# EAGLE design BQ25616_EvalBoard (EAGLE 9.6.2)
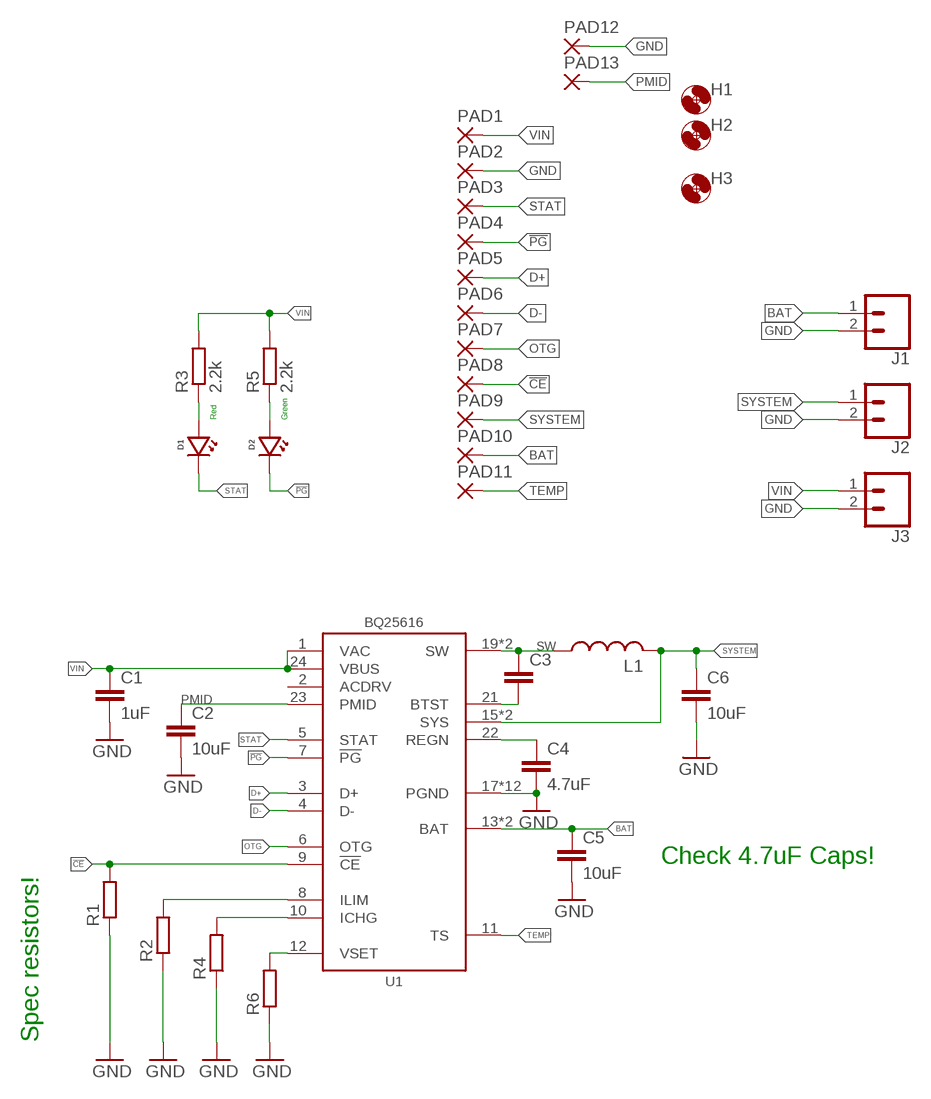
[diagram p0: schematic, sheet 1]

## Parts
C1  1uF  C-EU1UFC0603  [C0603]
C2  10uF  C-EU10UFC0805  [C0805]
C3  C-EUC0603  [C0603]
C4  4.7uF  C-EU4.7UFC0805  [C0805]
C5  10uF  C-EU10UFC0805  [C0805]
C6  10uF  C-EU10UFC0805  [C0805]
D1  LEDGREEN0603  [LED_0603]
D2  LEDRED0603  [LED_0603]
H1  MOUNTING_HOLE2_NP  [2_56]
H2  MOUNTING_HOLE2_NP  [2_56]
H3  MOUNTING_HOLE2_NP  [2_56]
J1  CONN_023.5MM_ROUND_RESTRICT  [SCREWTERMINAL-3.5MM-2_ROUND_RESTRICT]
J2  CONN_023.5MM_ROUND_RESTRICT  [SCREWTERMINAL-3.5MM-2_ROUND_RESTRICT]
J3  CONN_023.5MM_ROUND_RESTRICT  [SCREWTERMINAL-3.5MM-2_ROUND_RESTRICT]
L1  INDUCTORMAIA_4.1X4.1  [WE-MAIA(4.1X4.1)]
PAD1  SMD1,27  [SMD1,27-2,54]
PAD2  SMD1,27  [SMD1,27-2,54]
PAD3  SMD1,27  [SMD1,27-2,54]
PAD4  SMD1,27  [SMD1,27-2,54]
PAD5  SMD1,27  [SMD1,27-2,54]
PAD6  SMD1,27  [SMD1,27-2,54]
PAD7  SMD1,27  [SMD1,27-2,54]
PAD8  SMD1,27  [SMD1,27-2,54]
PAD9  SMD1,27  [SMD1,27-2,54]
PAD10  SMD1,27  [SMD1,27-2,54]
PAD11  SMD1,27  [SMD1,27-2,54]
PAD12  SMD1,27  [SMD1,27-2,54]
PAD13  SMD1,27  [SMD1,27-2,54]
R1  R-EU_R0603  [R0603]
R2  R-EU_R0603  [R0603]
R3  2.2k  R-EU_2.2KR0603  [R0603]
R4  R-EU_R0603  [R0603]
R5  2.2k  R-EU_2.2KR0603  [R0603]
R6  R-EU_R0603  [R0603]
U1  BQ25616  [QFN24_POWER]

## Nets
!CE: PAD8.1(P) R1.2 U1.9(!CE)
!PG: D2.CATHODE PAD4.1(P) U1.7(!PG)
BAT: C5.1 J1.1 PAD10.1(P) U1.13(BAT) U1.14(BAT)
D+: PAD5.1(P) U1.3(D+)
D-: PAD6.1(P) U1.4(D-)
GND: C1.2 C2.2 C4.2 C5.2 C6.2 J1.2 J2.2 J3.2 PAD2.1(P) PAD12.1(P) R1.1 R2.1 R4.1 R6.1 U1.17(PGND) U1.18(PGND) U1.EP(PGND) U1.EP@1(PGND) U1.EP@2(PGND) U1.EP@3(PGND) U1.EP@4(PGND) U1.EP@5(PGND) U1.EP@6(PGND) U1.EP@7(PGND) U1.EP@8(PGND) U1.EP@9(PGND)
N$2: C4.1 U1.22(REGN)
N$4: C3.2 U1.21(BTST)
N$5: D2.ANODE R5.1
N$6: D1.ANODE R3.1
N$8: R6.2 U1.12(VSET)
N$9: R4.2 U1.10(ICHG)
N$10: R2.2 U1.8(ILIM)
OTG: PAD7.1(P) U1.6(OTG)
PMID: C2.1 PAD13.1(P) U1.23(PMID)
STAT: D1.CATHODE PAD3.1(P) U1.5(STAT)
SW: C3.1 L1.P$1 U1.19(SW) U1.20(SW)
SYSTEM: C6.1 J2.1 L1.P$2 PAD9.1(P) U1.15(SYS) U1.16(SYS)
TEMP: PAD11.1(P) U1.11(TS)
VIN: C1.1 J3.1 PAD1.1(P) R3.2 R5.2 U1.1(VAC) U1.24(VBUS)
Unconnected: U1.2(ACDRV)

## Notes on the sheet
- Red | Green
- Check 4.7uF Caps!
- Spec resistors!

## Library data of the parts
C1 = bschulz_passives:C-EU: CAPACITOR, European symbol; DIGIKEY: 587-1251-1-ND; MF: Yaiyo Yuden; MPN: EMK107BJ105KA-T
C2 C5 C6 = bschulz_passives:C-EU: CAPACITOR, European symbol; DIGIKEY: 490-6473-6-ND; MF: Murata; MPN: GRM21BR61C106KE15K
C3 = bschulz_passives:C-EU: CAPACITOR, European symbol
C4 = bschulz_passives:C-EU: CAPACITOR, European symbol; DIGIKEY: 399-7415-1-ND; MF: Kemet; MPN: C0805C475K4RACTU
D1 = bschulz:LED: Genaric LED; DIGIKEY: 732-4971-1-ND; MF: Wurth; MPN: 150060GS75000
D2 = bschulz:LED: Genaric LED; DIGIKEY: 732-4978-1-ND; MF: Wurth; MPN: 150060RS75000
H1-H3 = bschulz:MOUNTING_HOLE: Genaric Mechanical Mounting Hole Hole diameter based on max body diameter + 15% Keepout ring is for diameter of socket cap screw (minimum required clearance) TPlace ring is for diameter of pan head screw (recomended clearance) Specifications: Socket Cap <http://fastener-express.com/fastener-technical/SocketscapSS-Alloy.pdf> Button Head Socket Cap <http://fastener-express.com/fastener-technical/Button-Socket-alloy.pdf> Pan Head <http://fastener-express.com/fastener-technical/pan-machine-Screws.pdf>; DIGIKEY: DNP; MF: N/A; MPN: DNP
J1-J3 = bschulz:CONN_02: Genaric 2 terminal header SCREW_2.54 <https://www.digikey.com/product-detail/en/on-shore-technology-inc/OSTVN02A150/ED10561-ND/1588862> 39532_RA <https://www.digikey.com/product-detail/en/molex/0395321002/WM7845-ND/1280696>; DIGIKEY: ED2635-ND; MF: On Shore; MPN: OSTTE020161
L1 = bschulz:INDUCTOR: Genaric inductor
PAD1-PAD13 = bschulz:SMD; DIGIKEY: N/A; MF: N/A; MPN: DNP
R1 R2 R4 R6 = bschulz_passives:R-EU_: RESISTOR, European symbol Digikey Parts: Yageo, 0402 <https://www.digikey.com/products/en/resistors/chip-resistor-surface-mount/52?k=&pkeyword=&sv=0&s=4356&sf=1&FV=-1%7C13%2C7%7C2%2C1291%7C39157%2C1989%7C0%2C-8%7C52%2C3%7C1131%2C3%7C2503&quantity=&ColumnSort=0&page=1&stock=1&pageSize=25> Yageo, 0603 <https://www.digikey.com/products/en/resistors/chip-resistor-surface-mount/52?k=&pkeyword=&sv=0&pv1291=39245&sf=1&FV=-5%7C4356%2C-5%7C47360%2C-8%7C52%2C-1%7C13%2C7%7C2%2C1989%7C0&quantity=10&ColumnSort=1000011&page=1&stock=1&pageSize=25> Panasonic, 0603 <https://www.digikey.com/products/en/resistors/chip-resistor-surface-mount/52?k=&pkeyword=&pv252=68&sf=0&FV=ffec373d%2C1c0002%2C142c040c%2C1f140000%2Cffe00034%2C80002%2Cc0001&quantity=&ColumnSort=0&page=1&stock=1&pageSize=25> Panasonic, precision, 0603 <https://www.digikey.com/products/en/resistors/chip-resistor-surface-mount/52?FV=ffec4907%2Cfffc000a%2Cc0172%2C142c040c%2C1f140000%2Cffe00034%2C1c0002&quantity=100&ColumnSort=2085&page=1&stock=1&pageSize=25> Panasonic, 0805 <https://www.digikey.com/products/en/resistors/chip-resistor-surface-mount/52?k=&pkeyword=&pv3=1&sf=0&FV=ffec373d%2C1c0002%2C1f140000%2Cffe00034%2C142c040d&quantity=&ColumnSort=0&page=1&stock=1&pageSize=25> Rohm, current sense <https://www.digikey.com/products/en/resistors/chip-resistor-surface-mount/52?k=&pkeyword=&pv3=1&sf=0&FV=ffecb688%2C1f140000%2Cffe00034%2C1c0002&quantity=&ColumnSort=0&page=1&stock=1&pageSize=25> Vishay, pulse proof automotive <https://www.digikey.com/products/en/resistors/chip-resistor-surface-mount/52?k=&pkeyword=&pv7=2&sf=0&FV=ffec5d6b%2Cffe00034%2C1f140000&quantity=&ColumnSort=0&page=1&stock=1&pageSize=25>; MF: Yageo
R3 R5 = bschulz_passives:R-EU_: RESISTOR, European symbol Digikey Parts: Yageo, 0402 <https://www.digikey.com/products/en/resistors/chip-resistor-surface-mount/52?k=&pkeyword=&sv=0&s=4356&sf=1&FV=-1%7C13%2C7%7C2%2C1291%7C39157%2C1989%7C0%2C-8%7C52%2C3%7C1131%2C3%7C2503&quantity=&ColumnSort=0&page=1&stock=1&pageSize=25> Yageo, 0603 <https://www.digikey.com/products/en/resistors/chip-resistor-surface-mount/52?k=&pkeyword=&sv=0&pv1291=39245&sf=1&FV=-5%7C4356%2C-5%7C47360%2C-8%7C52%2C-1%7C13%2C7%7C2%2C1989%7C0&quantity=10&ColumnSort=1000011&page=1&stock=1&pageSize=25> Panasonic, 0603 <https://www.digikey.com/products/en/resistors/chip-resistor-surface-mount/52?k=&pkeyword=&pv252=68&sf=0&FV=ffec373d%2C1c0002%2C142c040c%2C1f140000%2Cffe00034%2C80002%2Cc0001&quantity=&ColumnSort=0&page=1&stock=1&pageSize=25> Panasonic, precision, 0603 <https://www.digikey.com/products/en/resistors/chip-resistor-surface-mount/52?FV=ffec4907%2Cfffc000a%2Cc0172%2C142c040c%2C1f140000%2Cffe00034%2C1c0002&quantity=100&ColumnSort=2085&page=1&stock=1&pageSize=25> Panasonic, 0805 <https://www.digikey.com/products/en/resistors/chip-resistor-surface-mount/52?k=&pkeyword=&pv3=1&sf=0&FV=ffec373d%2C1c0002%2C1f140000%2Cffe00034%2C142c040d&quantity=&ColumnSort=0&page=1&stock=1&pageSize=25> Rohm, current sense <https://www.digikey.com/products/en/resistors/chip-resistor-surface-mount/52?k=&pkeyword=&pv3=1&sf=0&FV=ffecb688%2C1f140000%2Cffe00034%2C1c0002&quantity=&ColumnSort=0&page=1&stock=1&pageSize=25> Vishay, pulse proof automotive <https://www.digikey.com/products/en/resistors/chip-resistor-surface-mount/52?k=&pkeyword=&pv7=2&sf=0&FV=ffec5d6b%2Cffe00034%2C1f140000&quantity=&ColumnSort=0&page=1&stock=1&pageSize=25>; DIGIKEY: 311-2.20KHRCT-ND; MF: Yageo; MPN: RC0603FR-072K2L; VALUE_PART: 2.2k
U1 = bschulz:BQ25616: BQ25616 - Buck Battery Charger Standalone 1-Cell 3.0-A Buck Battery Charger with Power Path and 1.2-A Boost Operation Characteristics: Vin: 4V ~ 13.5V Vbat, Max: 4.35V ICharge, max: 3A IQ: 9.5μA Operating Temperature: -40°C to 85°C Digikey: 296-BQ25616RTWRCT-ND <https://www.digikey.com/en/products/detail/BQ25616RTWR/296-BQ25616RTWRCT-ND/11615905?itemSeq=348322194>; DIGIKEY: 296-BQ25616RTWRCT-ND; MF: TI; MPN: BQ25616RTWR

## Board
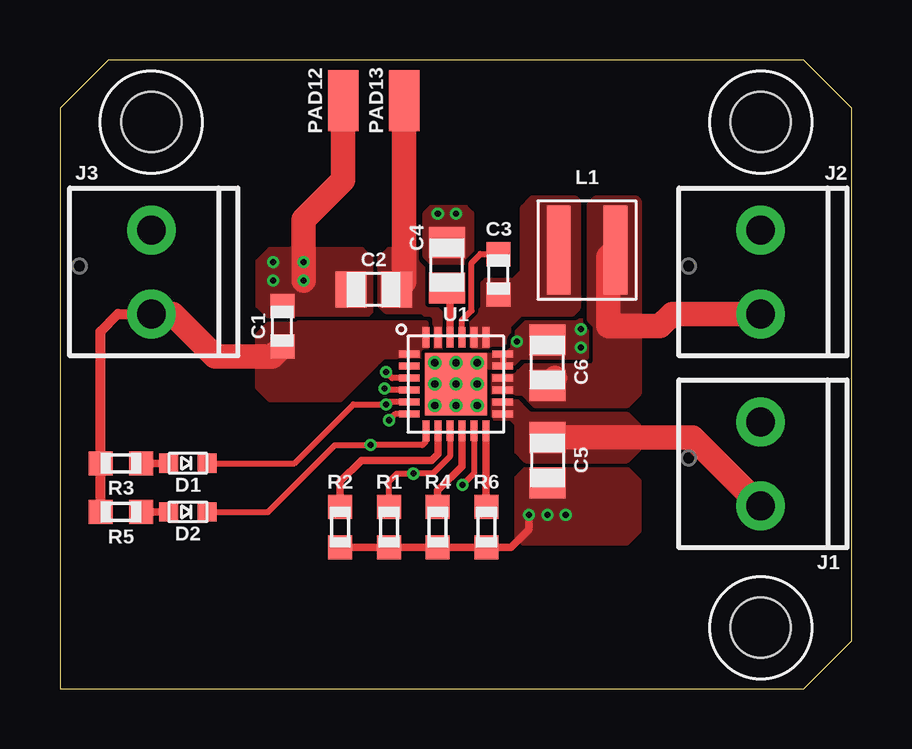
[diagram p1: board, top side]
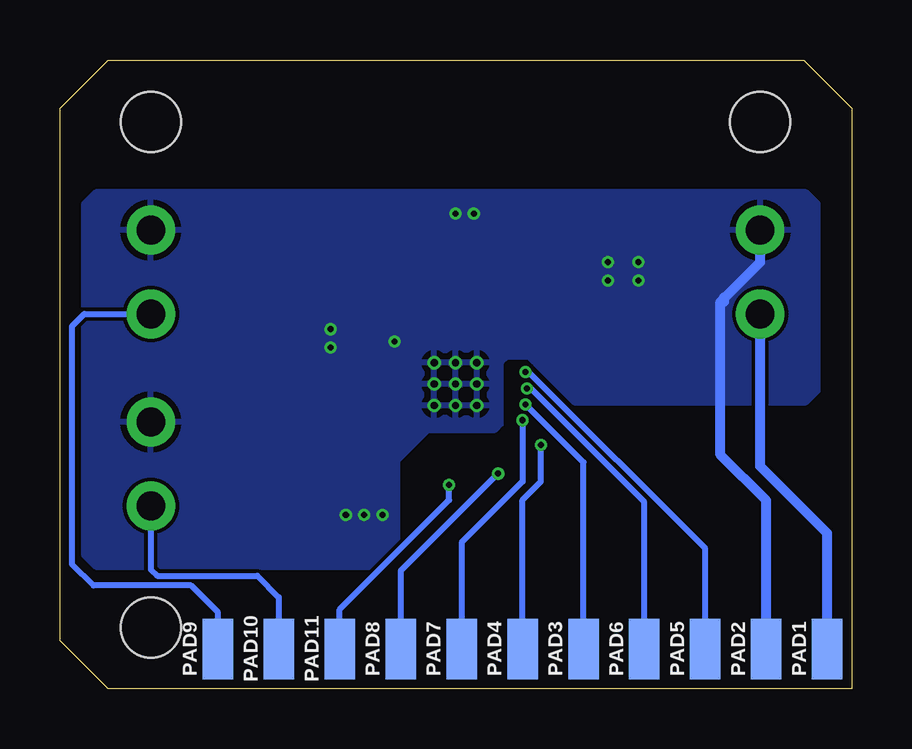
[diagram p2: board, bottom side, seen from below]

Size 33 x 26.21 mm. Coordinates in mm from the lower left corner, seen from the top.
Outline: 0,0 31,0 33,2 33,24.21 31,26.21 2,26.21 0,24.21 0,0
Copper layers (1*16): Top 0.035559375mm / dielectric 1.6mm / Bottom 0.035559375mm
Design rules "oshpark-2layer": minimum track width 6mil, minimum drill 10mil, track to track 6mil, track to pad 6mil, pad to pad 6mil, via to via 6mil, smd to smd 6mil, copper to edge 15mil, drill to drill 6mil, minimum pad ring 5mil, minimum via ring 5mil, stop-mask expansion 2.5mil, vias tented up to drill 0mil, thermal gap 10mil

### Footprints (pad centres in the part's own frame; a part is rotated, then mirrored left to right if it is on the bottom)
C0603 = smd 1 x 1: 1 -0.85,0; 2 0.85,0
C0805 = smd 1.3 x 1.5: 1 -0.95,0; 2 0.95,0
LED_0603 = smd 0.8 x 0.8: ANODE 0.8,0; CATHODE -0.8,0
2_56 = hole 2.5: 0,0
SCREWTERMINAL-3.5MM-2_ROUND_RESTRICT = drill 1.2 pad 2.032: 1 0,0; 2 3.5,0
WE-MAIA(4.1X4.1) = smd 0.98 x 3.7: P$1 -1.185,0; P$2 1.185,0
SMD1,27-2,54 = smd 1.27 x 2.54: 1 0,0
R0603 = smd 1 x 1: 1 -0.85,0; 2 0.85,0
QFN24_POWER = smd 0.85 x 0.28: 1 -1.95,1.25; 2 -1.95,0.75; 3 -1.95,0.25; 4 -1.95,-0.25; 5 -1.95,-0.75; 6 -1.95,-1.25; 13 1.95,-1.25; 14 1.95,-0.75; 15 1.95,-0.25; 16 1.95,0.25; 17 1.95,0.75; 18 1.95,1.25 | smd 0.28 x 0.85: 7 -1.25,-1.95; 8 -0.75,-1.95; 9 -0.25,-1.95; 10 0.25,-1.95; 11 0.75,-1.95; 12 1.25,-1.95; 19 1.25,1.95; 20 0.75,1.95; 21 0.25,1.95; 22 -0.25,1.95; 23 -0.75,1.95; 24 -1.25,1.95 | smd 2.6 x 2.6: EP 0,0 | drill 0.3: EP@1 -0.889,0.889; EP@2 0,0.889; EP@3 0.889,0.889; EP@4 -0.889,0; EP@5 0,0; EP@6 0.889,0; EP@7 -0.889,-0.889; EP@8 0,-0.889; EP@9 0.889,-0.889

### Placement (x,y rotation side)
C1  9.27,15.11 90 top
C2  13.08,16.64 180 top
C3  18.29,17.27 90 top
C4  16.13,17.65 90 top
C5  20.32,9.53 270 top
C6  20.32,13.59 90 top
D1  5.33,9.4 180 top
D2  5.33,7.37 180 top
H1  29.21,2.54 0 top
H2  29.21,23.62 0 top
H3  3.81,23.62 0 top
J1  29.21,7.62 90 top
J2  29.21,15.62 90 top
J3  3.81,15.62 90 top
L1  21.97,18.29 0 top
PAD1  1.02,1.65 0 bottom
PAD2  3.56,1.65 0 bottom
PAD3  11.18,1.65 0 bottom
PAD4  13.72,1.65 0 bottom
PAD5  6.1,1.65 0 bottom
PAD6  8.64,1.65 0 bottom
PAD7  16.26,1.65 0 bottom
PAD8  18.8,1.65 0 bottom
PAD9  26.42,1.65 0 bottom
PAD10  23.88,1.65 0 bottom
PAD11  21.34,1.65 0 bottom
PAD12  11.81,24.51 0 top
PAD13  14.35,24.51 0 top
R1  13.72,6.73 90 top
R2  11.68,6.73 90 top
R3  2.54,9.4 180 top
R4  15.75,6.73 90 top
R5  2.54,7.37 180 top
R6  17.78,6.73 90 top
U1  16.51,12.7 0 top

### Tracks (layer width: path | path; a pad name or v marks a point on that pad's centre or on a via)
!CE  (via drill 0.25)
  Top 0.254: U1.9 16.26,9.68 15.55,8.97 v14.73,8.97 14.05,8.97 13.72,8.64 R1.2
  Bottom 0.254: v14.73,8.97 18.8,4.9 PAD8.1
!PG  (via drill 0.25)
  Top 0.254: D2.CATHODE 8.67,7.37 11.47,10.16 v12.95,10.16 15.11,10.16 15.26,10.31 U1.7
  Bottom 0.254: PAD4.1 13.72,7.87 12.95,8.64 v12.95,10.16
BAT
  Top 1.016: J1.1 26.36,10.47 C5.1
  Bottom 0.254: J1.1 29.21,4.96 28.96,4.7 24.77,4.7 23.88,3.81 PAD10.1
  pour Top (rank 2, no thermals): 24.13,10.03 24.13,10.93 23.63,11.43 19.68,11.43 18.8,12.32 18.03,12.32 18.03,11.3 18.8,11.3 19.05,11.05 19.05,9.91 19.43,9.53 23.63,9.53
D+  (via drill 0.25)
  Top 0.254: U1.3 13.85,12.95 v13.59,13.21
  Bottom 0.254: PAD5.1 6.1,5.84 13.46,13.21 v13.59,13.21
D-  (via drill 0.25)
  Top 0.254: U1.4 13.59,12.45 v13.53,12.51
  Bottom 0.254: v13.53,12.51 | v13.53,12.51 13.37,12.51 8.64,7.78 PAD6.1
GND  (via drill 0.25)
  Top 0.254: U1.18 U1.17
  Top 0.305: v19.56,7.24 19.56,6.64 18.8,5.88 R6.1 R4.1 R1.1 R2.1
  Top 1.016: PAD12.1 11.81,21.21 10.16,19.56 v10.16,17.02
  Bottom 0.406: PAD2.1 3.56,7.85 5.46,9.75 5.46,16.13 3.81,17.78 J3.2 | 5.31,16.13 5.31,16.32
  other vias: 19.05,14.48 21.72,14.99 21.72,14.22 20.32,7.24 21.08,7.24 15.75,19.81 16.51,19.81 8.89,17.78 8.89,17.02 10.16,17.78
  pour Top (rank 2, no thermals): 18.03,14.22 18.41,14.22 19.56,15.37 21.84,15.37 22.1,15.11 22.1,13.72 21.59,13.21 17.65,13.21 17.65,13.84
  pour Top (rank 2, no thermals): 12.57,18.29 8.76,18.29 8.26,17.79 8.26,15.99 8.76,15.49 12.7,15.49 12.95,15.75 12.95,17.91
  pour Top (rank 3, no thermals): 19.43,9.14 19.05,8.76 19.05,6.35 19.3,6.1 23.63,6.1 24.13,6.6 24.13,8.64 23.63,9.14
  pour Top (no thermals): 15.49,17.78 15.24,18.03 15.24,19.81 15.49,20.07 16.89,20.07 17.14,19.81 17.14,18.03 16.89,17.78
  pour Bottom: 11.56,11.94 1.9,11.94 1.4,12.44 1.4,20.2 1.9,20.7 31.5,20.7 32,20.2 32,5.58 31.5,5.08 19.94,5.08 18.92,6.1 18.92,9.53 17.65,10.79 14.86,10.79 14.61,11.05 14.61,13.59 14.35,13.84 13.46,13.84
N$2
  Top 0.305: U1.22 16.26,16.57 C4.1
N$4
  Top 0.254: U1.21 16.76,15.36 17.16,15.76 17.16,17.75 17.53,18.12 C3.2
N$5
  Top 0.305: R5.1 D2.ANODE
N$6
  Top 0.305: R3.1 D1.ANODE
N$8
  Top 0.305: R6.2 17.76,7.6 U1.12
N$9
  Top 0.305: U1.10 16.76,9.27 15.75,8.26 R4.2
N$10
  Top 0.305: U1.8 15.76,9.79 15.49,9.53 12.57,9.53 11.68,8.64 R2.2
OTG  (via drill 0.25)
  Top 0.254: U1.6 13.97,11.45 v13.72,11.19
  Bottom 0.254: v13.72,11.19 13.72,8.64 16.26,6.1 PAD7.1
PMID
  Top 1.016: PAD13.1 14.35,16.96 C2.1
  pour Top (rank 3, no thermals): 13.34,17.91 13.34,16 13.59,15.75 15.11,15.75 15.49,15.37 15.49,14.22 15.62,14.1 16,14.1 16,15.49 15.24,16.26 15.24,17.91 14.86,18.29 13.72,18.29
STAT  (via drill 0.25)
  Top 0.254: U1.5 13.69,11.95 v13.59,11.85 12.23,11.85 9.78,9.4 D1.CATHODE
  Bottom 0.254: PAD3.1 11.18,9.44 v13.59,11.85
SW
  pour Top (no thermals): 17.14,14.35 17.14,15.37 17.65,15.88 17.65,16.89 17.78,17.02 18.92,17.02 19.3,17.4 19.3,20.07 19.68,20.45 21.46,20.45 21.59,20.32 21.59,15.88 21.34,15.62 19.18,15.62 18.67,15.11 18.67,14.61 18.29,14.22 17.27,14.22
SYSTEM
  Top 1.016: 20.64,12.95 C6.1 | L1.P$2 22.86,17.99 22.86,15.11 25.02,15.11 25.53,15.62 J2.1
  Bottom 0.254: PAD9.1 26.42,3.17 27.54,4.3 31.6,4.3 32.49,5.19 32.49,15.11 31.98,15.62 J2.1
  pour Top (no thermals): 22.1,20.19 22.35,20.45 24,20.45 24.13,20.32 24.13,12.31 23.63,11.81 19.81,11.81 19.3,12.32 17.91,12.32 17.91,13.08 18.03,13.21 19.18,13.21 19.43,13.46 22.23,13.46 22.35,13.59 22.35,15.11 22.1,15.37
TEMP  (via drill 0.25)
  Top 0.254: U1.11 17.26,8.98 v16.78,8.49
  Bottom 0.254: PAD11.1 21.34,3.3 16.78,7.86 v16.78,8.49
VIN
  Top 0.406: J3.1 2.41,15.62 1.69,14.9 R3.2 R5.2
  Top 1.016: J3.1 4.7,15.62 6.48,13.84 8.85,13.84 C1.1
  Bottom 0.406: J3.1 3.81,9.27 1.02,6.48 PAD1.1
  pour Top (no thermals): 15.24,15.24 15.24,13.84 13.46,13.84 11.68,12.06 8.76,12.06 8.26,12.56 8.26,14.74 8.76,15.24

### Text on the board
tDocu: Break44 | GND | PMID | + | Sys | - | + | Vin | - | - | STAT | + | !PG | Bat | BQ25616 Eval Board / v0.0 / Bobby Schulz
bDocu: Vin | GND | D+ | D- | STAT | !PG | OTG | !CE | TEMP | BAT | SYS